# Altium schematic sheet 13_Sensors_Onboard.SchDoc
size 420 x 297 mm; SheetNumber: 21; SheetTotal: 29
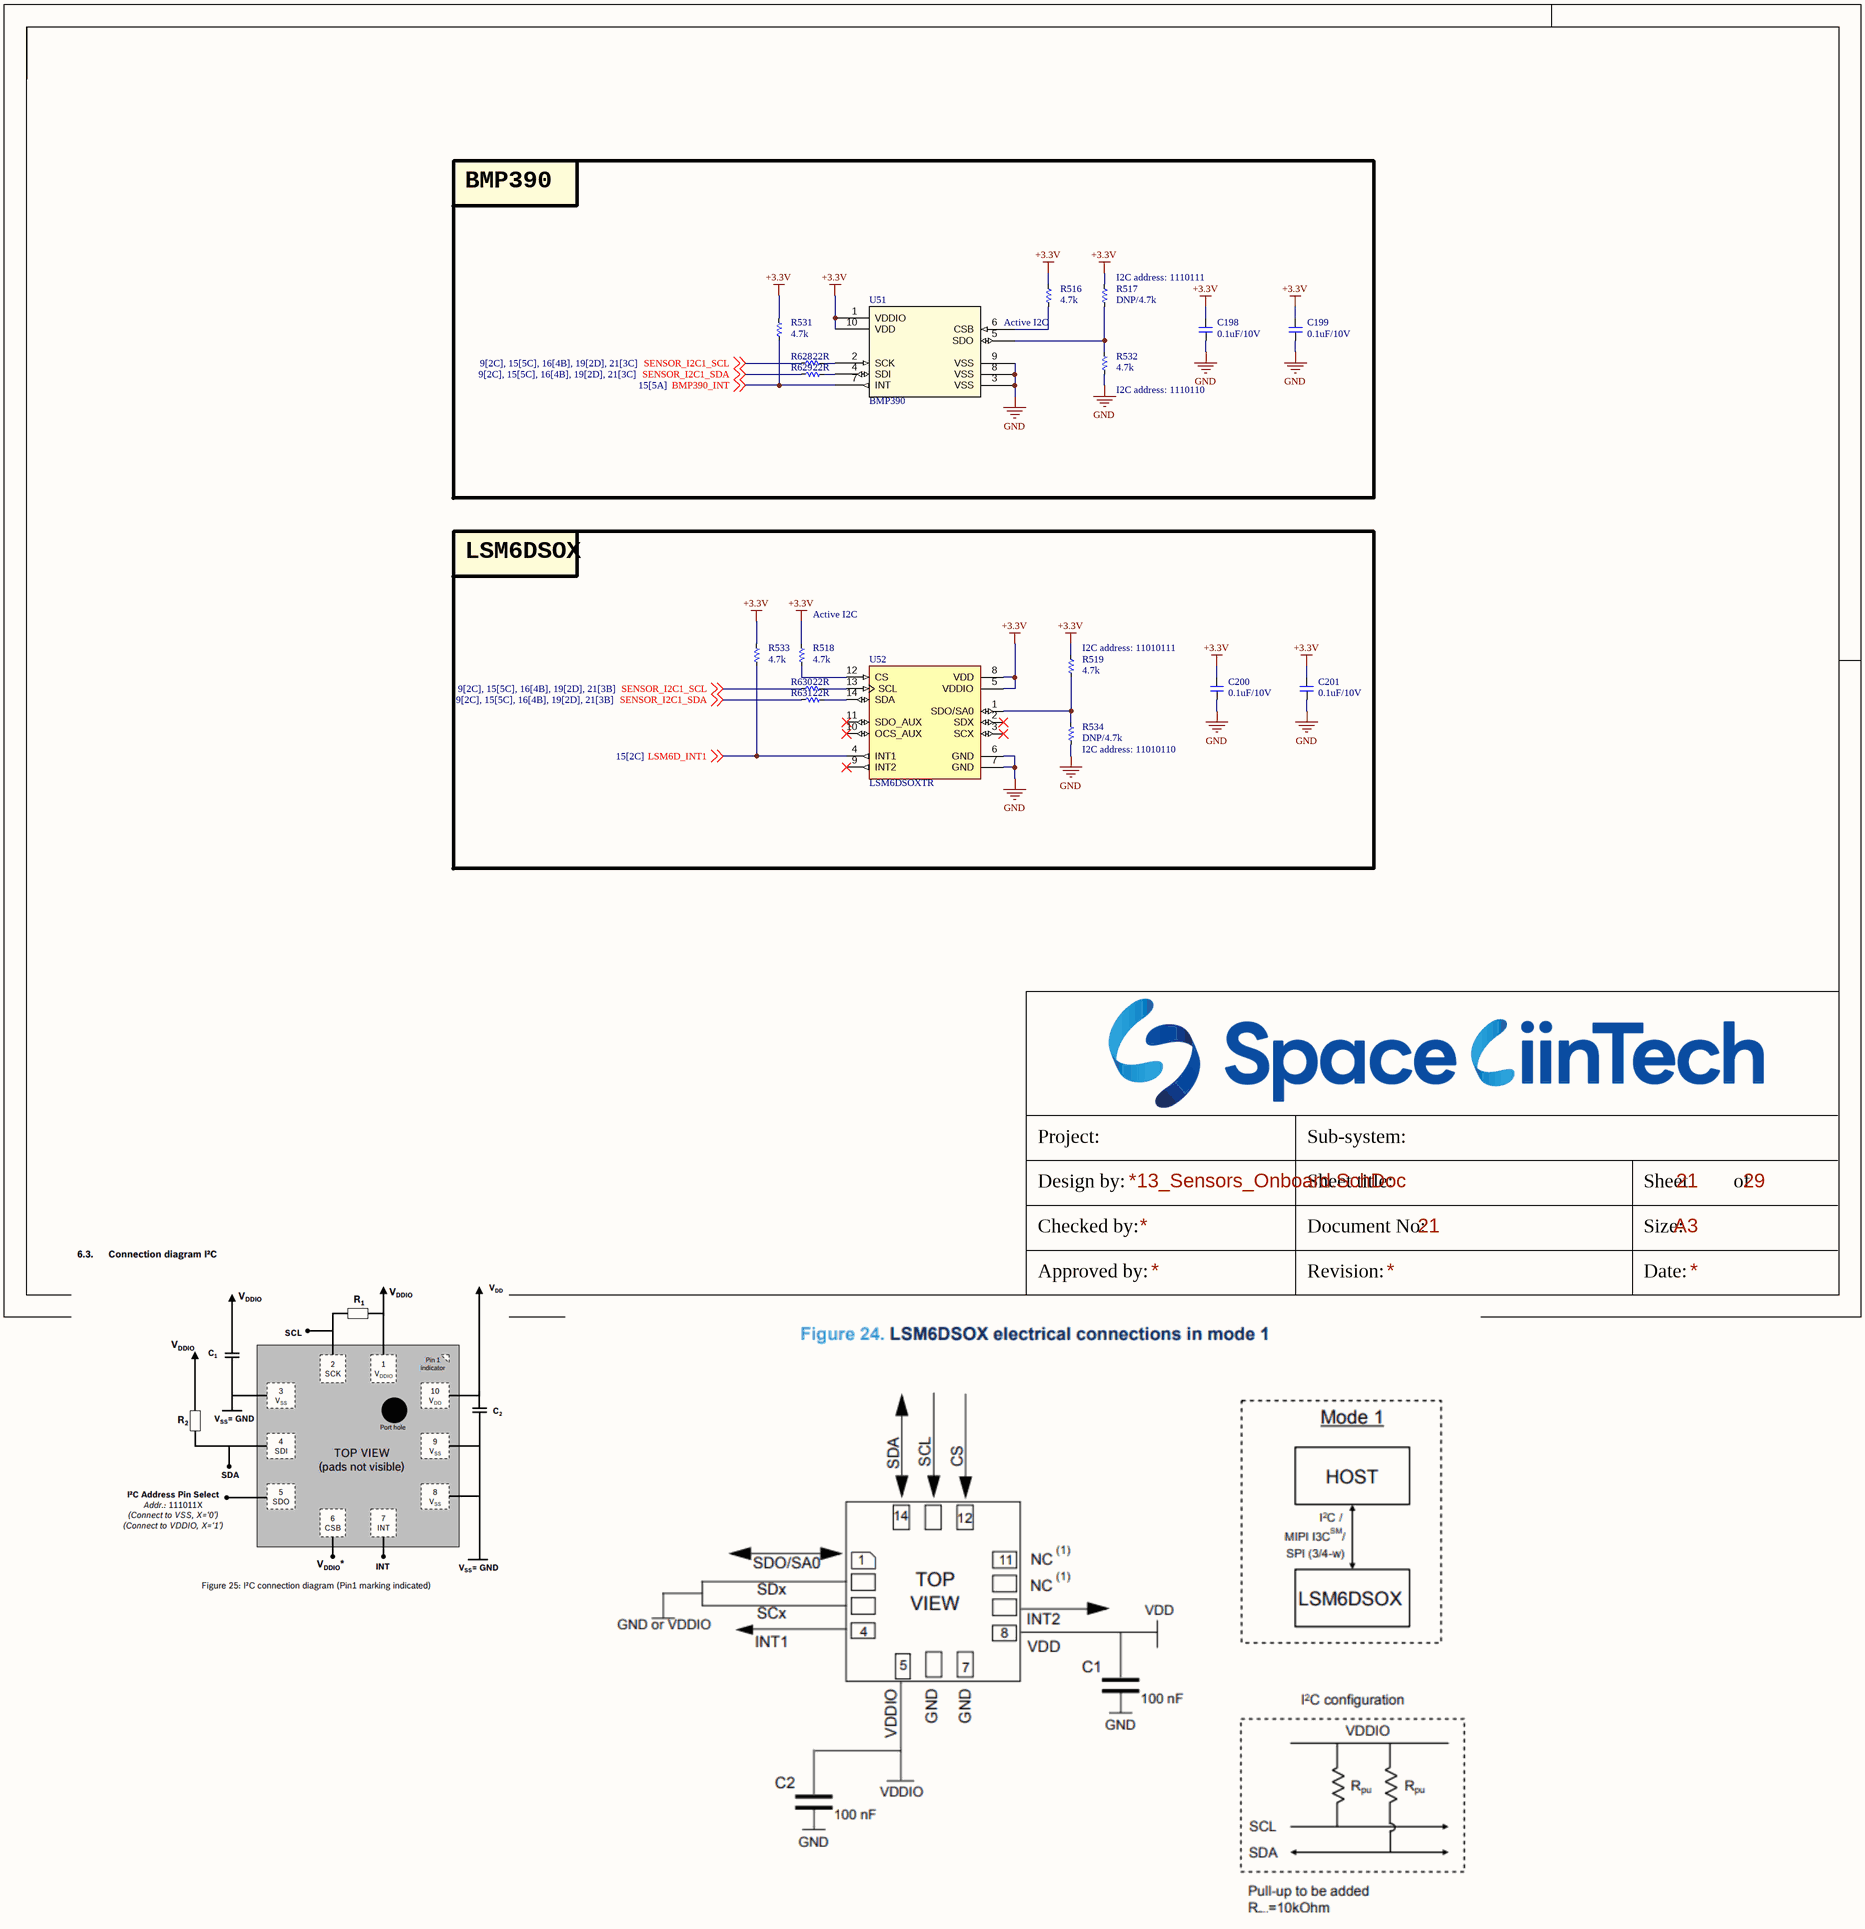
[diagram p0: 13_Sensors_Onboard.SchDoc]

## Parts
C198  0.1uF/10V  [CAP_C_1005X60]
C199  0.1uF/10V  [CAP_C_1005X60]
C200  0.1uF/10V  [CAP_C_1005X60]
C201  0.1uF/10V  [CAP_C_1005X60]
R516  4.7k  [RES_C_1005X40]
R517  DNP/4.7k  [RES_C_1005X40]
R518  4.7k  [RES_C_1005X40]
R519  4.7k  [RES_C_1005X40]
R531  4.7k  [RES_C_1005X40]
R532  4.7k  [RES_C_1005X40]
R533  4.7k  [RES_C_1005X40]
R534  DNP/4.7k  [RES_C_1005X40]
R628  22R  [RES_C_1005X40]
R629  22R  [RES_C_1005X40]
R630  22R  [RES_C_1005X40]
R631  22R  [RES_C_1005X40]
U51  BMP390  [10LGA_2X2X0p75_BOS]
U52  LSM6DSOXTR  [PQFN50P250X300X86-14N]

## Blocks framed on the sheet
BMP390: C198 C199 R516 R517 R531 R532 R628 R629 U51
LSM6DSOX: C200 C201 R518 R519 R533 R534 R630 R631 U52

## Nets
+3.3V: C198.2 C199.2 C200.2 C201.2 R516.1 R517.1 R518.1 R519.1 R531.1 R533.1 U51.1(VDDIO) U51.10(VDD) U52.5(VDDIO) U52.8(VDD)
GND: C198.1 C199.1 C200.1 C201.1 R532.2 R534.2 U51.3(VSS) U51.8(VSS) U51.9(VSS) U52.6(GND) U52.7(GND)
BMP390_INT: R531.2 U51.7(INT) ; off-sheet BMP390_INT
LSM6D_INT1: R533.2 U52.4(INT1) ; off-sheet LSM6D_INT1
SENSOR_I2C1_SCL: R628.1 R630.1 ; off-sheet SENSOR_I2C1_SCL
SENSOR_I2C1_SDA: R629.1 R631.1 ; off-sheet SENSOR_I2C1_SDA
NetR516_2: R516.2 U51.6(CSB)
NetR517_2: R517.2 R532.1 U51.5(SDO)
NetR518_2: R518.2 U52.12(CS)
NetR519_2: R519.2 R534.1 U52.1(SDO/SA0)
NetR628_2: R628.2 U51.2(SCK)
NetR629_2: R629.2 U51.4(SDI)
NetR630_2: R630.2 U52.13(SCL)
NetR631_2: R631.2 U52.14(SDA)

Not connected (* = marked no-connect by the designer): U52 2(SDX)* 3(SCX)* 9(INT2)* 10(OCS_AUX)* 11(SDO_AUX)*

## Notes on the sheet
- Active I2C
- (near R517) I2C address: 1110111
- (near R532) I2C address: 1110110
- (near R518) Active I2C
- (near R519) I2C address: 11010111
- (near R534) I2C address: 11010110
- Project:
- Sub-system:
- Design by:
- Sheet title:
- Sheet
- of
- Checked by:
- Approved by:
- Revision:
- Document No:
- Size:
- Date:
- A3

## Library data of the parts
C198-C201 = _CAP_C_2: CAP CHIP
R516-R519 R531-R534 R628-R631 = _RES_B_2: RES
U51 = BMP390: Description; Manufacturer_Name: Bosch Sensortec; Copyright: Copyright (C) 2025 Ultra Librarian. All rights reserved.; Manufacturer_Part_Number: BMP390; RefDes: RefDes; Type: Type
U52 = LSM6DSOXTR: Accelerometer, Gyroscope, 6 Axis Sensor I2C, SPI Output; MF: STMicroelectronics; SnapEDA_Link: https://www.snapeda.com/parts/LSM6DSOXTR/STMicroelectronics/view-part/?ref=snap; Package: VFLGA-14 STMicroelectronics; Value: *; MP: LSM6DSOXTR; Check_prices: https://www.snapeda.com/parts/LSM6DSOXTR/STMicroelectronics/view-part/?ref=eda